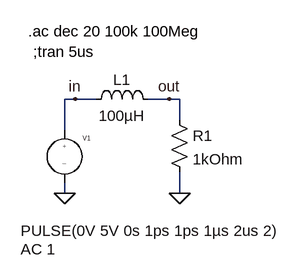
[diagram p0: schematic tiefpass.asc]
tiefpass.asc, the LTspice schematic file:
Version 4
SHEET 1 880 680
WIRE 112 144 96 144
WIRE 144 144 112 144
WIRE 256 144 224 144
WIRE 272 144 256 144
WIRE 272 176 272 144
WIRE 96 192 96 144
WIRE 96 288 96 272
WIRE 272 288 272 256
FLAG 272 288 0
FLAG 96 288 0
FLAG 256 144 out
FLAG 112 144 in
SYMBOL ind 128 160 R270
WINDOW 0 30 56 VTop 2
WINDOW 3 6 56 VBottom 2
SYMATTR InstName L1
SYMATTR Value 100µH
SYMBOL res 256 160 R0
SYMATTR InstName R1
SYMATTR Value 1kOhm
SYMBOL source-V 96 176 R0
WINDOW 3 -67 170 Left 2
WINDOW 123 -67 198 Left 2
WINDOW 39 0 0 Left 2
SYMATTR InstName V1
SYMATTR Value PULSE(0V 5V 0s 1ps 1ps 1µs 2us 2)
SYMATTR Value2 AC 1
TEXT 48 72 Left 2 !;tran 5us
TEXT 40 40 Left 2 !.ac dec 20 100k 100Meg

The netlist it stands for:
* tiefpass.asc
L1 in out 100µH
R1 out 0 1kOhm
V1 in 0 PULSE(0V 5V 0s 1ps 1ps 1µs 2us 2) AC 1
;tran 5us
.ac dec 20 100k 100Meg
.backanno
.end